# EAGLE schematic projetoFinal (EAGLE 9.6.2)

## Sheet 1 of 7
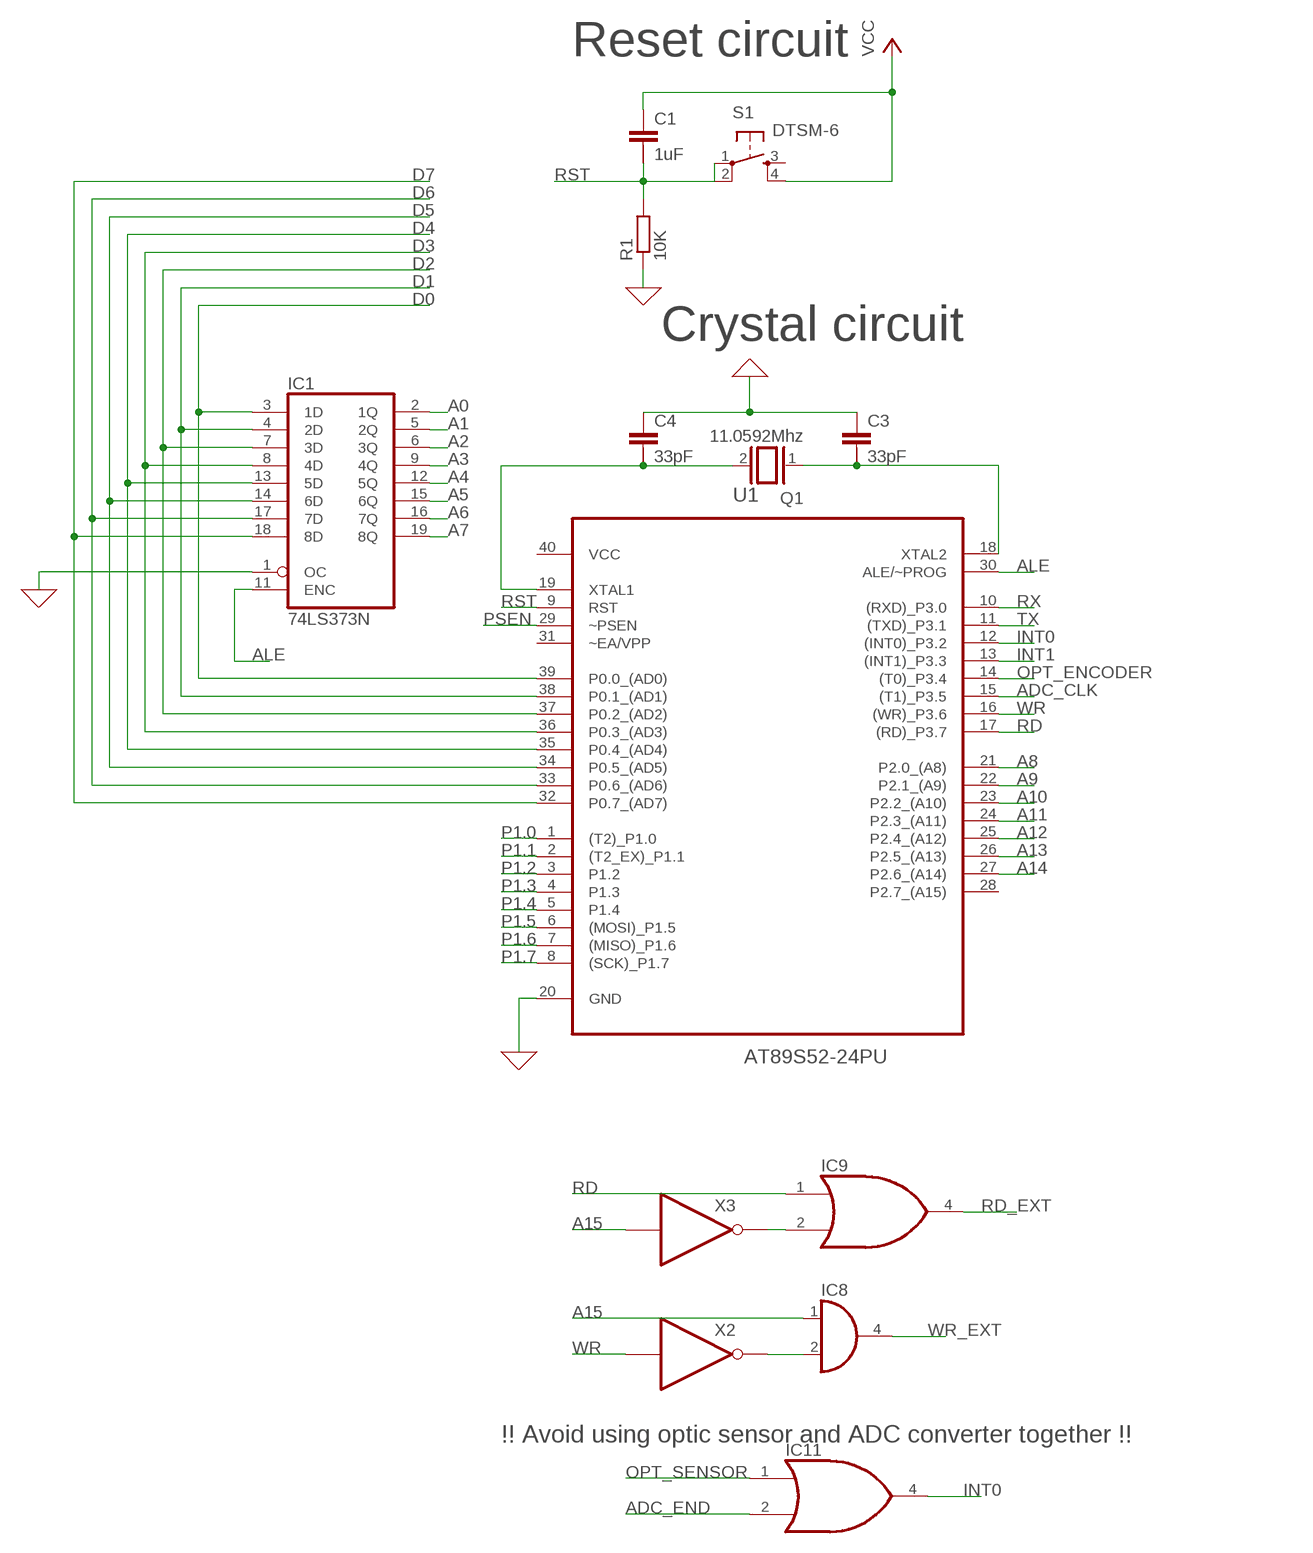
[diagram p0: schematic, sheet 1]

### Parts
C1  1uF  C-2.5-5/2  [C2.5/5-2]
C3  33pF  C-2.5-5/2  [C2.5/5-2]
C4  33pF  C-2.5-5/2  [C2.5/5-2]
IC1  74LS373N  [DIL20]
IC8  74LVC1G08DBV  [SOT23-5]
IC9  74AUC1G32DBV  [SOT23-5]
IC11  74AUC1G32DBV  [SOT23-5]
Q1  11.0592Mhz  XTAL  [Q]
R1  10K  R-EU_0204/7  [0204/7]
S1  DTSM-6  [DTSM-6]
U1  AT89S52-24PU  [DIP254P1524X482-40]
X2  INVERTER  (no package)
X3  INVERTER  (no package)

### Nets
0: C3.1 C4.1 IC1.1(OC) R1.1 U1.20(GND) ; supply symbol labelled GND ; also sheet 2,3,4,5,6,7
A0: IC1.2(1Q) ; also sheet 3,4,5,6,7
A1: IC1.5(2Q) ; also sheet 3,5,6,7
A2: IC1.6(3Q) ; also sheet 3,4,5,6,7
A3: IC1.9(4Q) ; also sheet 3,4,5,6,7
A4: IC1.12(5Q) ; also sheet 7
A5: IC1.15(6Q) ; also sheet 7
A6: IC1.16(7Q) ; also sheet 7
A7: IC1.19(8Q) ; also sheet 7
A8: U1.21(P2.0_(A8)) ; also sheet 7
A9: U1.22(P2.1_(A9)) ; also sheet 7
A10: U1.23(P2.2_(A10)) ; also sheet 7
A11: U1.24(P2.3_(A11)) ; also sheet 7
A12: U1.25(P2.4_(A12)) ; also sheet 7
A13: U1.26(P2.5_(A13)) ; also sheet 7
A14: U1.27(P2.6_(A14)) ; also sheet 7
A15: IC8.1(I0) X3.I ; also sheet 7
ADC_CLK: U1.15((T1)_P3.5) ; also sheet 3
ADC_END: IC11.2(I1) ; also sheet 3
ALE: IC1.11(ENC) U1.30(ALE/~PROG)
D0: IC1.3(1D) U1.39(P0.0_(AD0)) ; also sheet 3,4,5,6,7
D1: IC1.4(2D) U1.38(P0.1_(AD1)) ; also sheet 3,4,5,6,7
D2: IC1.7(3D) U1.37(P0.2_(AD2)) ; also sheet 3,4,5,6,7
D3: IC1.8(4D) U1.36(P0.3_(AD3)) ; also sheet 3,4,5,6,7
D4: IC1.13(5D) U1.35(P0.4_(AD4)) ; also sheet 3,4,5,6,7
D5: IC1.14(6D) U1.34(P0.5_(AD5)) ; also sheet 3,4,5,6,7
D6: IC1.17(7D) U1.33(P0.6_(AD6)) ; also sheet 3,4,5,6,7
D7: IC1.18(8D) U1.32(P0.7_(AD7)) ; also sheet 3,4,5,6,7
INT0: IC11.4(O) U1.12((INT0)_P3.2) ; also sheet 4
INT1: U1.13((INT1)_P3.3)
N$1: C4.2 Q1.2 U1.19(XTAL1)
N$2: C3.2 Q1.1 U1.18(XTAL2)
N$31: IC8.2(I1) X2.O
N$32: IC9.2(I1) X3.O
OPT_ENCODER: U1.14((T0)_P3.4) ; also sheet 2
OPT_SENSOR: IC11.1(I0) ; also sheet 2
P1.0: U1.1((T2)_P1.0) ; also sheet 5
P1.1: U1.2((T2_EX)_P1.1) ; also sheet 5
P1.2: U1.3(P1.2) ; also sheet 5
P1.3: U1.4(P1.3)
P1.4: U1.5(P1.4)
P1.5: U1.6((MOSI)_P1.5)
P1.6: U1.7((MISO)_P1.6)
P1.7: U1.8((SCK)_P1.7)
PSEN: U1.29(~PSEN) ; also sheet 7
RD: IC9.1(I0) U1.17((RD)_P3.7) ; also sheet 7
RD_EXT: IC9.4(O) ; also sheet 3,4
RST: C1.2 R1.2 S1.1 S1.2 U1.9(RST)
RX: U1.10((RXD)_P3.0) ; also sheet 2
TX: U1.11((TXD)_P3.1) ; also sheet 2
VCC: C1.1 S1.4 ; also sheet 2,3,4,5,7
WR: U1.16((WR)_P3.6) X2.I ; also sheet 7
WR_EXT: IC8.4(O) ; also sheet 3,4,5,6
Unconnected: C1.3 C3.3 C4.3 S1.3 U1.28(P2.7_(A15)) U1.31(~EA/VPP)

### Notes on the sheet
- Reset circuit
- Crystal circuit
- !! Avoid using optic sensor and ADC converter together !!

## Sheet 2 of 7
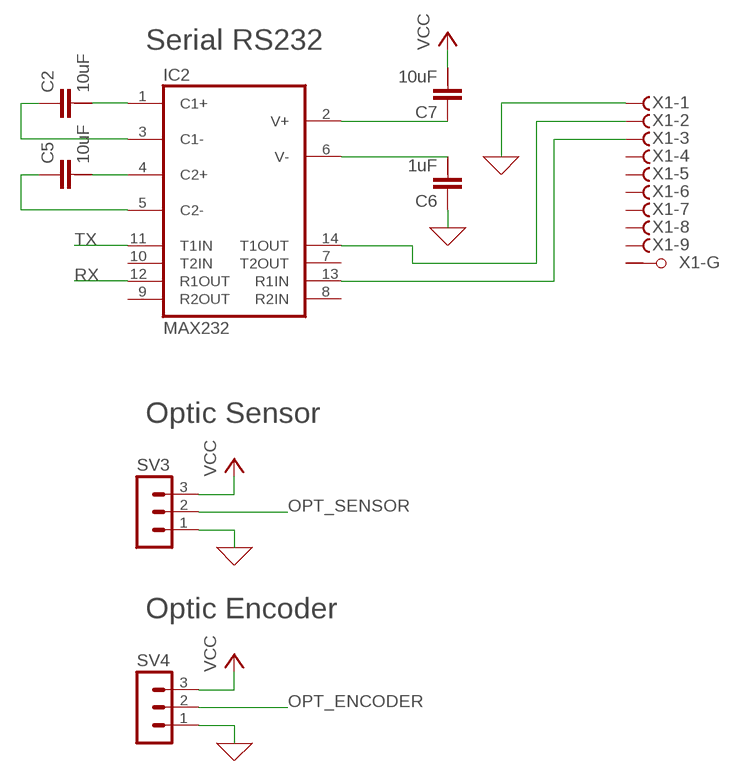
[diagram p1: schematic, sheet 2]

### Parts
C2  10uF  C-2.5-5/2  [C2.5/5-2]
C5  10uF  C-2.5-5/2  [C2.5/5-2]
C6  1uF  C-2.5-5/2  [C2.5/5-2]
C7  10uF  C-2.5-5/2  [C2.5/5-2]
IC2  MAX232  [DIL16]
SV3  MA03-1  [MA03-1]
SV4  MA03-1  [MA03-1]
X1  F09VPS  [F09VP]

### Nets
0: C6.1 C6.2 IC2.6(V-) SV3.1 SV4.1 X1.1(-1:F) ; supply symbol labelled GND ; also sheet 1,3,4,5,6,7
N$3: C2.2 IC2.1(C1+)
N$4: C2.1 IC2.3(C1-)
N$5: C5.2 IC2.4(C2+)
N$6: C5.1 IC2.5(C2-)
N$7: C7.1 IC2.2(V+)
N$8: IC2.14(T1OUT) X1.2(-2:F)
N$9: IC2.13(R1IN) X1.3(-3:F)
OPT_ENCODER: SV4.2 ; also sheet 1
OPT_SENSOR: SV3.2 ; also sheet 1
RX: IC2.12(R1OUT) ; also sheet 1
TX: IC2.11(T1IN) ; also sheet 1
VCC: C7.2 SV3.3 SV4.3 ; also sheet 1,3,4,5,7
Unconnected: C2.3 C5.3 C6.3 C7.3 IC2.7(T2OUT) IC2.8(R2IN) IC2.9(R2OUT) IC2.10(T2IN) X1.4(-4:F) X1.5(-5:F) X1.6(-6:F) X1.7(-7:F) X1.8(-8:F) X1.9(-9:F) X1.G1(-G:G1) X1.G2(-G:G2)

### Notes on the sheet
- Serial RS232
- Optic Sensor
- Optic Encoder

## Sheet 3 of 7
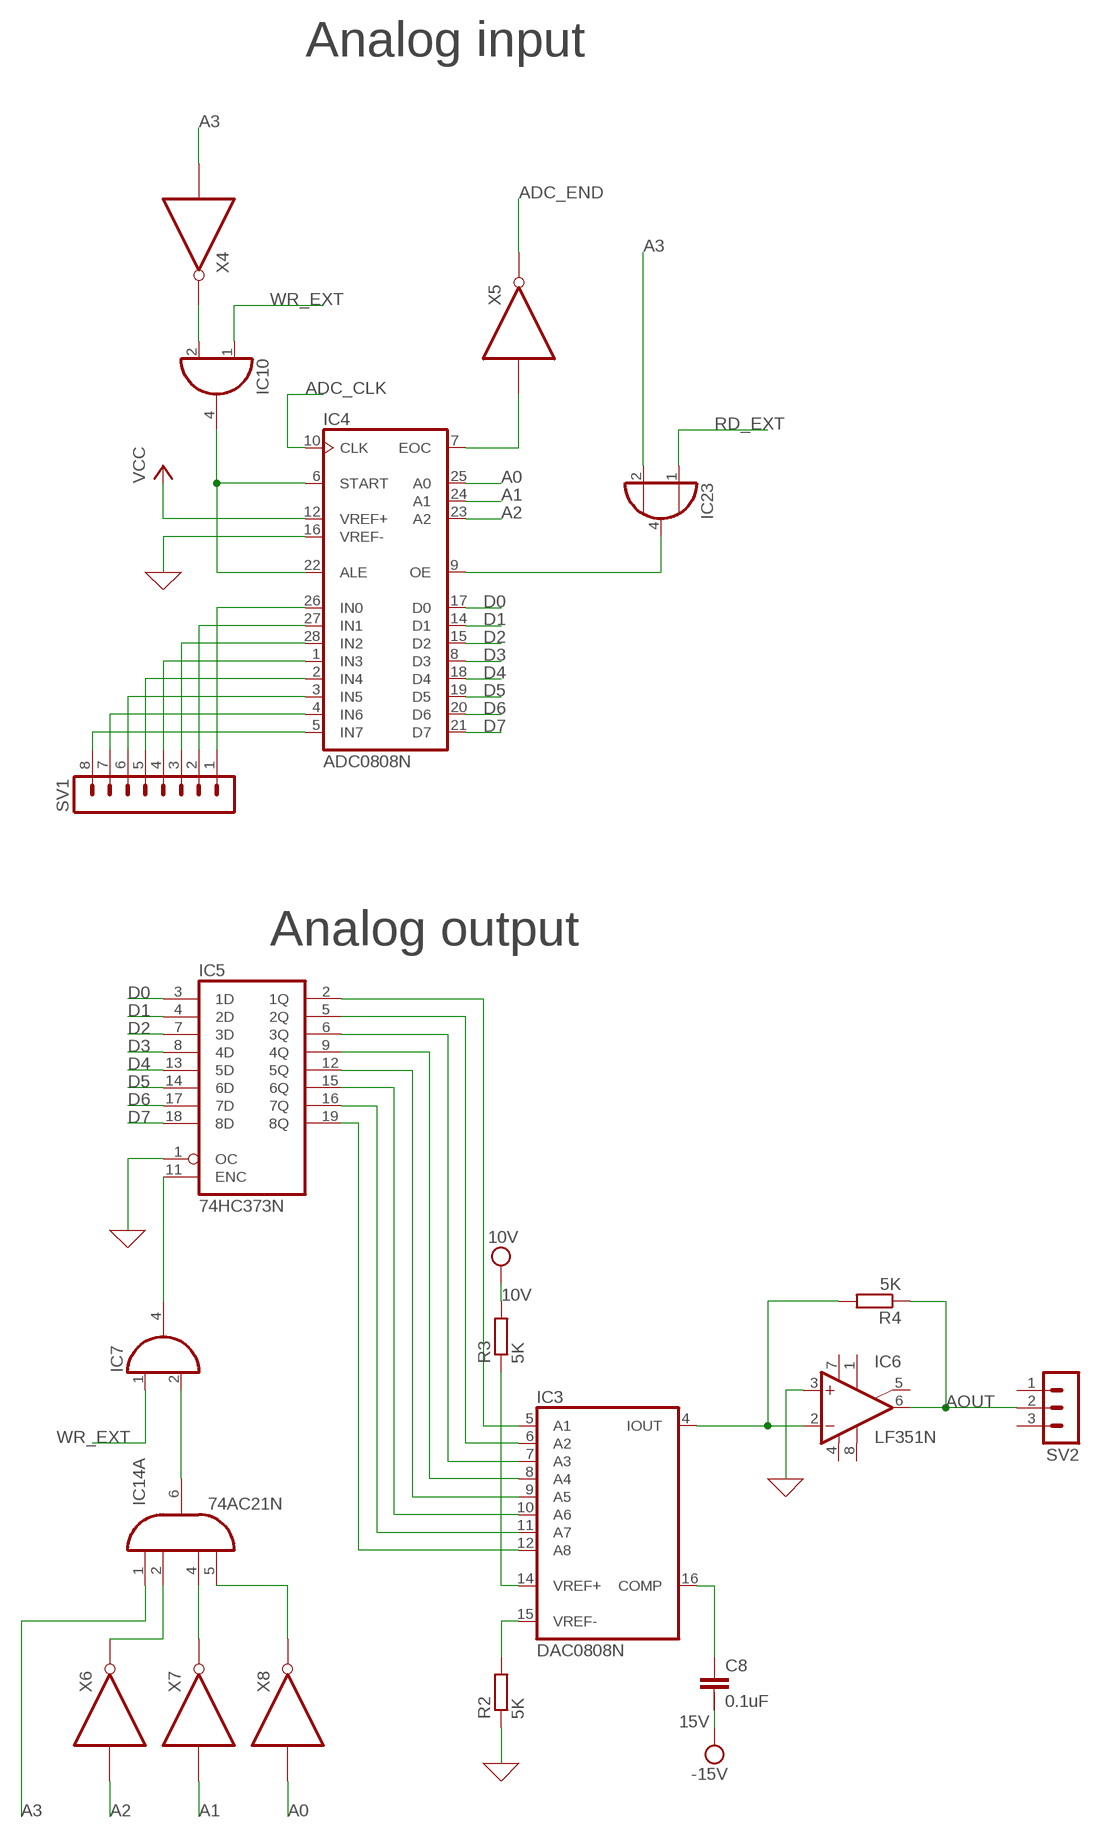
[diagram p2: schematic, sheet 3]

### Parts
C8  0.1uF  C-2.5-5/2  [C2.5/5-2]
IC3  DAC0808N  [DIL16]
IC4  ADC0808N  [DIL28-6]
IC5  74HC373N  [DIL20]
IC6  LF351N  [DIL08]
IC7  74LVC1G08DBV  [SOT23-5]
IC10  74LVC1G08DBV  [SOT23-5]
IC14  74AC21N  [DIL14]
IC23  74AHCT1G32DBV  [SOT23-5]
R2  5K  R-EU_0204/7  [0204/7]
R3  5K  R-EU_0204/7  [0204/7]
R4  5K  R-EU_0204/7  [0204/7]
SV1  MA08-1  [MA08-1]
SV2  MA03-1  [MA03-1]
X4  INVERTER  (no package)
X5  INVERTER  (no package)
X6  INVERTER  (no package)
X7  INVERTER  (no package)
X8  INVERTER  (no package)

### Nets
0: IC4.16(VREF-) IC5.1(OC) IC6.3(+IN) R2.1 ; supply symbol labelled GND ; also sheet 1,2,4,5,6,7
10V: R3.2
15V: C8.2 ; supply symbol labelled -15V
A0: IC4.25(A0) X8.I ; also sheet 1,4,5,6,7
A1: IC4.24(A1) X7.I ; also sheet 1,5,6,7
A2: IC4.23(A2) X6.I ; also sheet 1,4,5,6,7
A3: IC14.1(A:I0) X4.I ; also sheet 1,4,5,6,7
ADC_CLK: IC4.10(CLK) ; also sheet 1
ADC_END: X5.O ; also sheet 1
AOUT: IC6.6(OUT) R4.1 SV2.2
D0: IC4.17(D0) IC5.3(1D) ; also sheet 1,4,5,6,7
D1: IC4.14(D1) IC5.4(2D) ; also sheet 1,4,5,6,7
D2: IC4.15(D2) IC5.7(3D) ; also sheet 1,4,5,6,7
D3: IC4.8(D3) IC5.8(4D) ; also sheet 1,4,5,6,7
D4: IC4.18(D4) IC5.13(5D) ; also sheet 1,4,5,6,7
D5: IC4.19(D5) IC5.14(6D) ; also sheet 1,4,5,6,7
D6: IC4.20(D6) IC5.17(7D) ; also sheet 1,4,5,6,7
D7: IC4.21(D7) IC5.18(8D) ; also sheet 1,4,5,6,7
N$10: IC4.26(IN0) SV1.1
N$11: IC4.27(IN1) SV1.2
N$12: IC4.28(IN2) SV1.3
N$13: IC4.1(IN3) SV1.4
N$14: IC4.2(IN4) SV1.5
N$15: IC4.3(IN5) SV1.6
N$16: IC4.4(IN6) SV1.7
N$17: IC4.5(IN7) SV1.8
N$18: IC3.5(A1) IC5.2(1Q)
N$19: IC3.6(A2) IC5.5(2Q)
N$20: IC3.7(A3) IC5.6(3Q)
N$21: IC3.8(A4) IC5.9(4Q)
N$22: IC3.9(A5) IC5.12(5Q)
N$23: IC3.10(A6) IC5.15(6Q)
N$24: IC3.11(A7) IC5.16(7Q)
N$25: IC3.12(A8) IC5.19(8Q)
N$26: IC5.11(ENC) IC7.4(O)
N$27: IC3.15(VREF-) R2.2
N$28: IC3.14(VREF+) R3.1
N$29: C8.1 IC3.16(COMP)
N$30: IC3.4(IOUT) IC6.2(-IN) R4.2
N$33: IC23.2(I1)
N$34: IC4.9(OE) IC23.4(O)
N$41: IC4.6(START) IC4.22(ALE) IC10.4(O)
N$42: IC10.2(I1) X4.O
N$43: IC4.7(EOC) X5.I
N$69: IC14.2(A:I1) X6.O
N$70: IC14.4(A:I2) X7.O
N$71: IC14.5(A:I3) X8.O
N$76: IC7.2(I1) IC14.6(A:O)
RD_EXT: IC23.1(I0) ; also sheet 1,4
VCC: IC4.12(VREF+) ; also sheet 1,2,4,5,7
WR_EXT: IC7.1(I0) IC10.1(I0) ; also sheet 1,4,5,6
Unconnected: C8.3 IC6.1(ON1) IC6.5(ON2) IC6.8(OPT) IC14.8(B:O) IC14.9(B:I0) IC14.10(B:I1) IC14.12(B:I2) IC14.13(B:I3) SV2.1 SV2.3

### Notes on the sheet
- Analog input
- Analog output

## Sheet 4 of 7
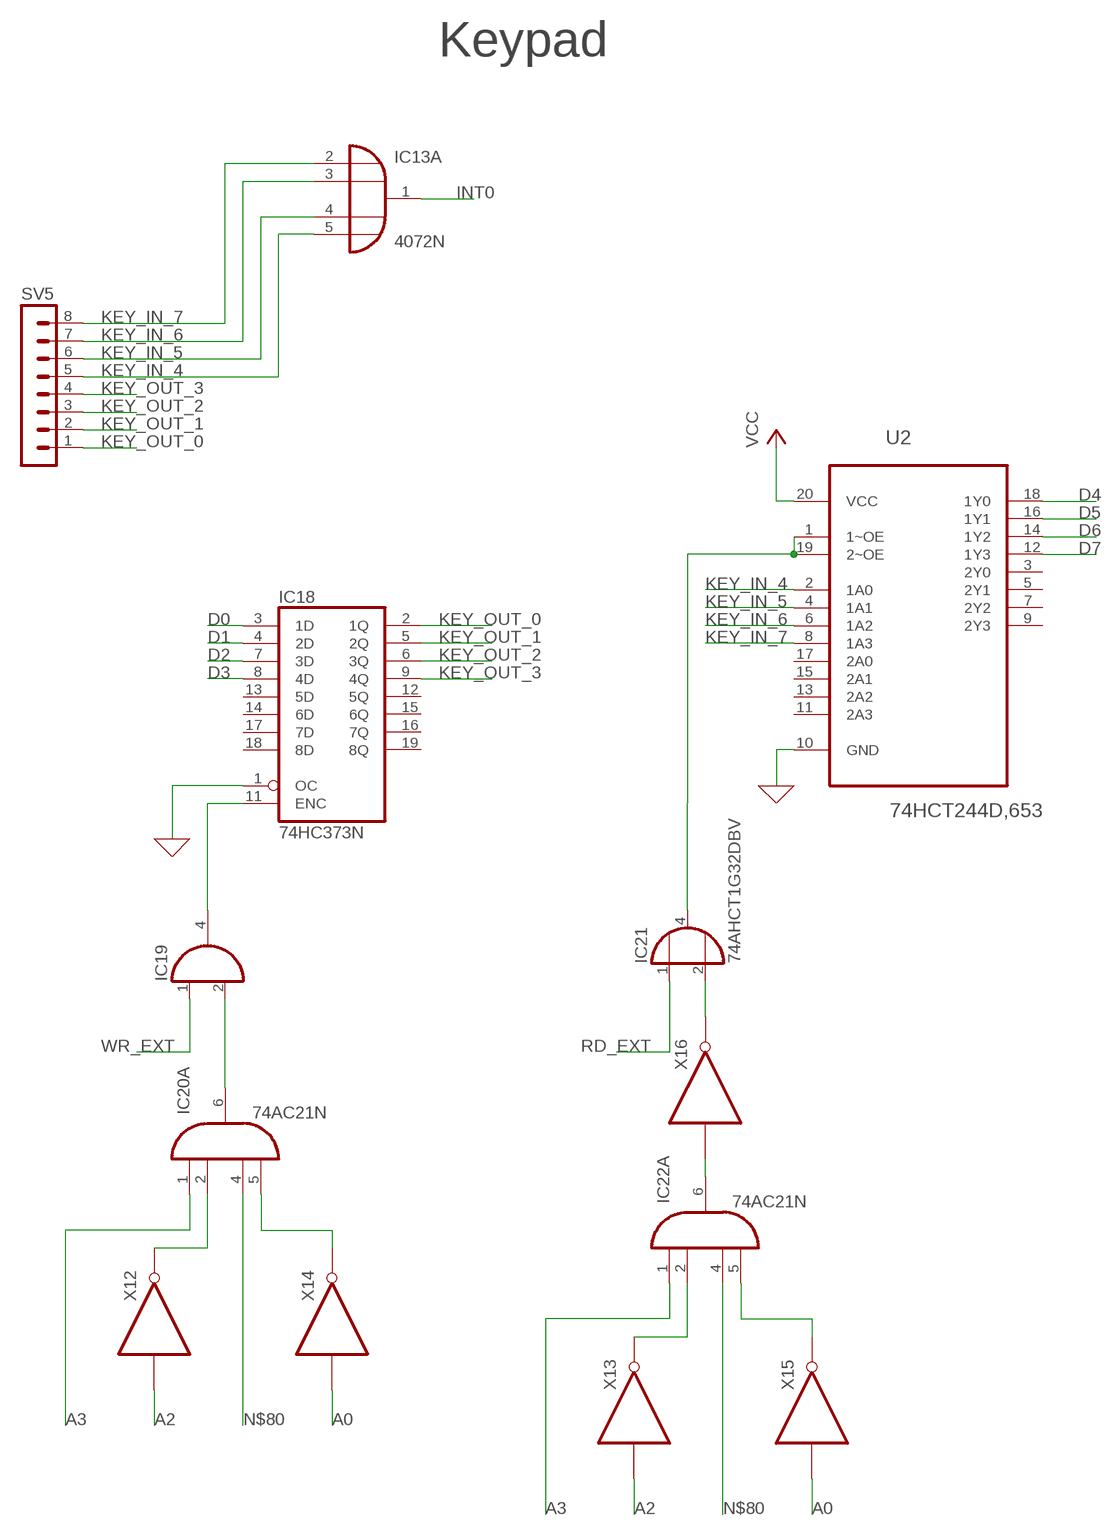
[diagram p3: schematic, sheet 4]

### Parts
IC13  4072N  [DIL14]
IC18  74HC373N  [DIL20]
IC19  74LVC1G08DBV  [SOT23-5]
IC20  74AC21N  [DIL14]
IC21  74AHCT1G32DBV  [SOT23-5]
IC22  74AC21N  [DIL14]
SV5  MA08-1  [MA08-1]
U2  74HCT244D,653  [SOIC127X1032X265-20N]
X12  INVERTER  (no package)
X13  INVERTER  (no package)
X14  INVERTER  (no package)
X15  INVERTER  (no package)
X16  INVERTER  (no package)

### Nets
0: IC18.1(OC) U2.10(GND) ; supply symbol labelled GND ; also sheet 1,2,3,5,6,7
A0: X14.I X15.I ; also sheet 1,3,5,6,7
A2: X12.I X13.I ; also sheet 1,3,5,6,7
A3: IC20.1(A:I0) IC22.1(A:I0) ; also sheet 1,3,5,6,7
D0: IC18.3(1D) ; also sheet 1,3,5,6,7
D1: IC18.4(2D) ; also sheet 1,3,5,6,7
D2: IC18.7(3D) ; also sheet 1,3,5,6,7
D3: IC18.8(4D) ; also sheet 1,3,5,6,7
D4: U2.18(1Y0) ; also sheet 1,3,5,6,7
D5: U2.16(1Y1) ; also sheet 1,3,5,6,7
D6: U2.14(1Y2) ; also sheet 1,3,5,6,7
D7: U2.12(1Y3) ; also sheet 1,3,5,6,7
INT0: IC13.1(A:O) ; also sheet 1
KEY_IN_4: IC13.5(A:I3) SV5.5 U2.2(1A0)
KEY_IN_5: SV5.6 U2.4(1A1)
KEY_IN_6: IC13.3(A:I1) SV5.7 U2.6(1A2)
KEY_IN_7: IC13.2(A:I0) SV5.8 U2.8(1A3)
KEY_OUT_0: IC18.2(1Q) SV5.1
KEY_OUT_1: IC18.5(2Q) SV5.2
KEY_OUT_2: IC18.6(3Q) SV5.3
KEY_OUT_3: IC18.9(4Q) SV5.4
N$36: IC20.5(A:I3) X14.O
N$37: IC13.4(A:I2)
N$38: IC22.2(A:I1) X13.O
N$39: IC21.2(I1) X16.O
N$40: IC21.4(O)
N$72: IC22.5(A:I3) X15.O
N$75: IC22.6(A:O) X16.I
N$78: U2.1(1~OE) U2.19(2~OE)
N$79: IC20.2(A:I1) X12.O
N$80: IC20.4(A:I2) IC22.4(A:I2)
N$81: IC19.2(I1) IC20.6(A:O)
N$82: IC18.11(ENC) IC19.4(O)
RD_EXT: IC21.1(I0) ; also sheet 1,3
VCC: U2.20(VCC) ; also sheet 1,2,3,5,7
WR_EXT: IC19.1(I0) ; also sheet 1,3,5,6
Unconnected: IC13.9(B:I0) IC13.10(B:I1) IC13.11(B:I2) IC13.12(B:I3) IC13.13(B:O) IC18.12(5Q) IC18.13(5D) IC18.14(6D) IC18.15(6Q) IC18.16(7Q) IC18.17(7D) IC18.18(8D) IC18.19(8Q) IC20.8(B:O) IC20.9(B:I0) IC20.10(B:I1) IC20.12(B:I2) IC20.13(B:I3) IC22.8(B:O) IC22.9(B:I0) IC22.10(B:I1) IC22.12(B:I2) IC22.13(B:I3) U2.3(2Y0) U2.5(2Y1) U2.7(2Y2) U2.9(2Y3) U2.11(2A3) U2.13(2A2) U2.15(2A1) U2.17(2A0)

### Notes on the sheet
- Keypad

## Sheet 5 of 7
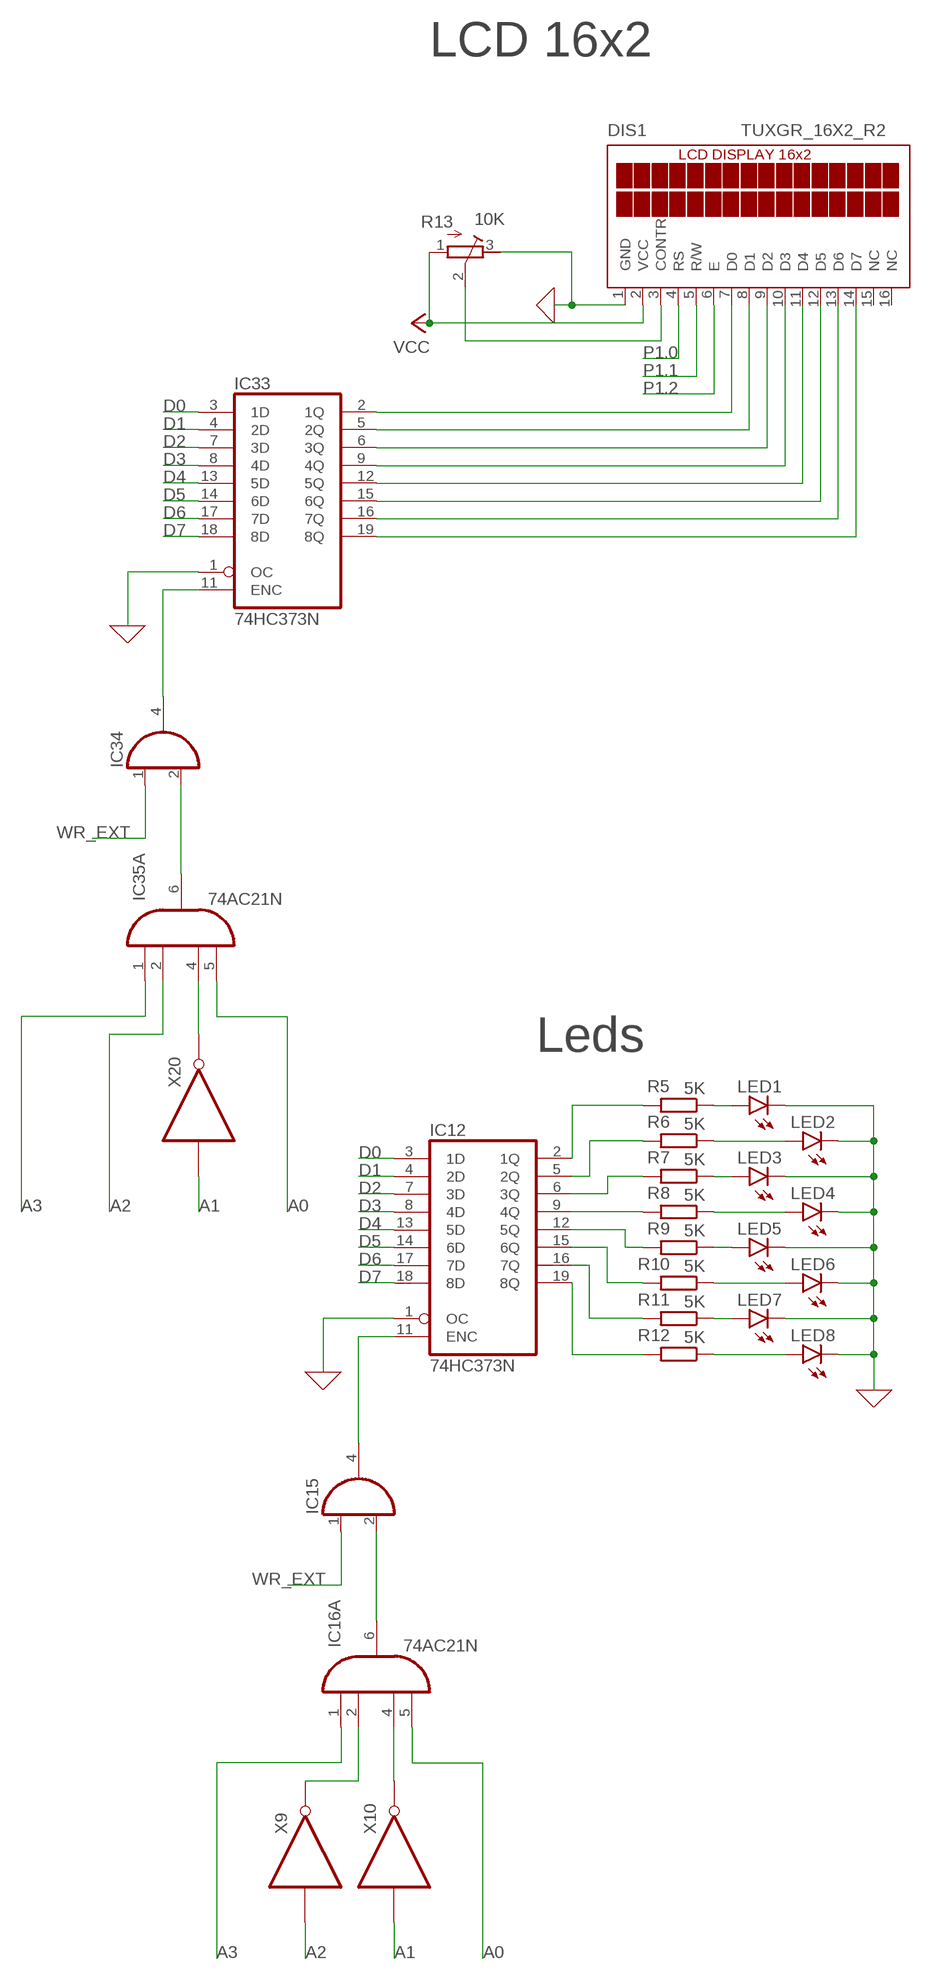
[diagram p4: schematic, sheet 5]

### Parts
DIS1  TUXGR_16X2_R2  [TUXGR_16X2_R2]
IC12  74HC373N  [DIL20]
IC15  74LVC1G08DBV  [SOT23-5]
IC16  74AC21N  [DIL14]
IC33  74HC373N  [DIL20]
IC34  74LVC1G08DBV  [SOT23-5]
IC35  74AC21N  [DIL14]
LED1  TLLR4400  [LED3MM]
LED2  TLLR4400  [LED3MM]
LED3  TLLR4400  [LED3MM]
LED4  TLLR4400  [LED3MM]
LED5  TLLR4400  [LED3MM]
LED6  TLLR4400  [LED3MM]
LED7  TLLR4400  [LED3MM]
LED8  TLLR4400  [LED3MM]
R5  5K  R-EU_0204/7  [0204/7]
R6  5K  R-EU_0204/7  [0204/7]
R7  5K  R-EU_0204/7  [0204/7]
R8  5K  R-EU_0204/7  [0204/7]
R9  5K  R-EU_0204/7  [0204/7]
R10  5K  R-EU_0204/7  [0204/7]
R11  5K  R-EU_0204/7  [0204/7]
R12  5K  R-EU_0204/7  [0204/7]
R13  10K  R-TRIMM3339P  [RTRIM3339P]
X9  INVERTER  (no package)
X10  INVERTER  (no package)
X20  INVERTER  (no package)

### Nets
0: DIS1.1(GND) IC12.1(OC) IC33.1(OC) R13.3(E) ; supply symbol labelled GND ; also sheet 1,2,3,4,6,7
A0: IC16.5(A:I3) IC35.5(A:I3) ; also sheet 1,3,4,6,7
A1: X10.I X20.I ; also sheet 1,3,6,7
A2: IC35.2(A:I1) X9.I ; also sheet 1,3,4,6,7
A3: IC16.1(A:I0) IC35.1(A:I0) ; also sheet 1,3,4,6,7
D0: IC12.3(1D) IC33.3(1D) ; also sheet 1,3,4,6,7
D1: IC12.4(2D) IC33.4(2D) ; also sheet 1,3,4,6,7
D2: IC12.7(3D) IC33.7(3D) ; also sheet 1,3,4,6,7
D3: IC12.8(4D) IC33.8(4D) ; also sheet 1,3,4,6,7
D4: IC12.13(5D) IC33.13(5D) ; also sheet 1,3,4,6,7
D5: IC12.14(6D) IC33.14(6D) ; also sheet 1,3,4,6,7
D6: IC12.17(7D) IC33.17(7D) ; also sheet 1,3,4,6,7
D7: IC12.18(8D) IC33.18(8D) ; also sheet 1,3,4,6,7
N$35: IC12.11(ENC) IC15.4(O)
N$44: DIS1.7(D0) IC33.2(1Q)
N$45: DIS1.8(D1) IC33.5(2Q)
N$46: DIS1.9(D2) IC33.6(3Q)
N$47: DIS1.10(D3) IC33.9(4Q)
N$48: DIS1.11(D4) IC33.12(5Q)
N$49: DIS1.12(D5) IC33.15(6Q)
N$50: DIS1.13(D6) IC33.16(7Q)
N$51: DIS1.14(D7) IC33.19(8Q)
N$52: LED1.A R5.1
N$53: LED2.A R6.1
N$54: LED3.A R7.1
N$55: LED4.A R8.1
N$56: LED5.A R9.1
N$57: LED6.A R10.1
N$58: LED7.A R11.1
N$59: LED8.A R12.1
N$60: IC12.2(1Q) R5.2
N$61: LED1.K(C) LED2.K(C) LED3.K(C) LED4.K(C) LED5.K(C) LED6.K(C) LED7.K(C) LED8.K(C) ; supply symbol labelled GND
N$62: IC12.5(2Q) R6.2
N$63: IC12.6(3Q) R7.2
N$64: IC12.9(4Q) R8.2
N$65: IC12.19(8Q) R12.2
N$66: IC12.16(7Q) R11.2
N$67: IC12.15(6Q) R10.2
N$68: IC12.12(5Q) R9.2
N$73: IC16.2(A:I1) X9.O
N$74: IC16.4(A:I2) X10.O
N$77: IC15.2(I1) IC16.6(A:O)
N$108: DIS1.3(CONTR) R13.2(S)
N$119: IC35.4(A:I2) X20.O
N$125: IC34.2(I1) IC35.6(A:O)
N$126: IC33.11(ENC) IC34.4(O)
P1.0: DIS1.4(RS) ; also sheet 1
P1.1: DIS1.5(R/W) ; also sheet 1
P1.2: DIS1.6(E) ; also sheet 1
VCC: DIS1.2(VCC) R13.1(A) ; also sheet 1,2,3,4,7
WR_EXT: IC15.1(I0) IC34.1(I0) ; also sheet 1,3,4,6
Unconnected: DIS1.15(NC) DIS1.16(NC) IC16.8(B:O) IC16.9(B:I0) IC16.10(B:I1) IC16.12(B:I2) IC16.13(B:I3) IC35.8(B:O) IC35.9(B:I0) IC35.10(B:I1) IC35.12(B:I2) IC35.13(B:I3)

### Notes on the sheet
- LCD 16x2
- Leds

## Sheet 6 of 7
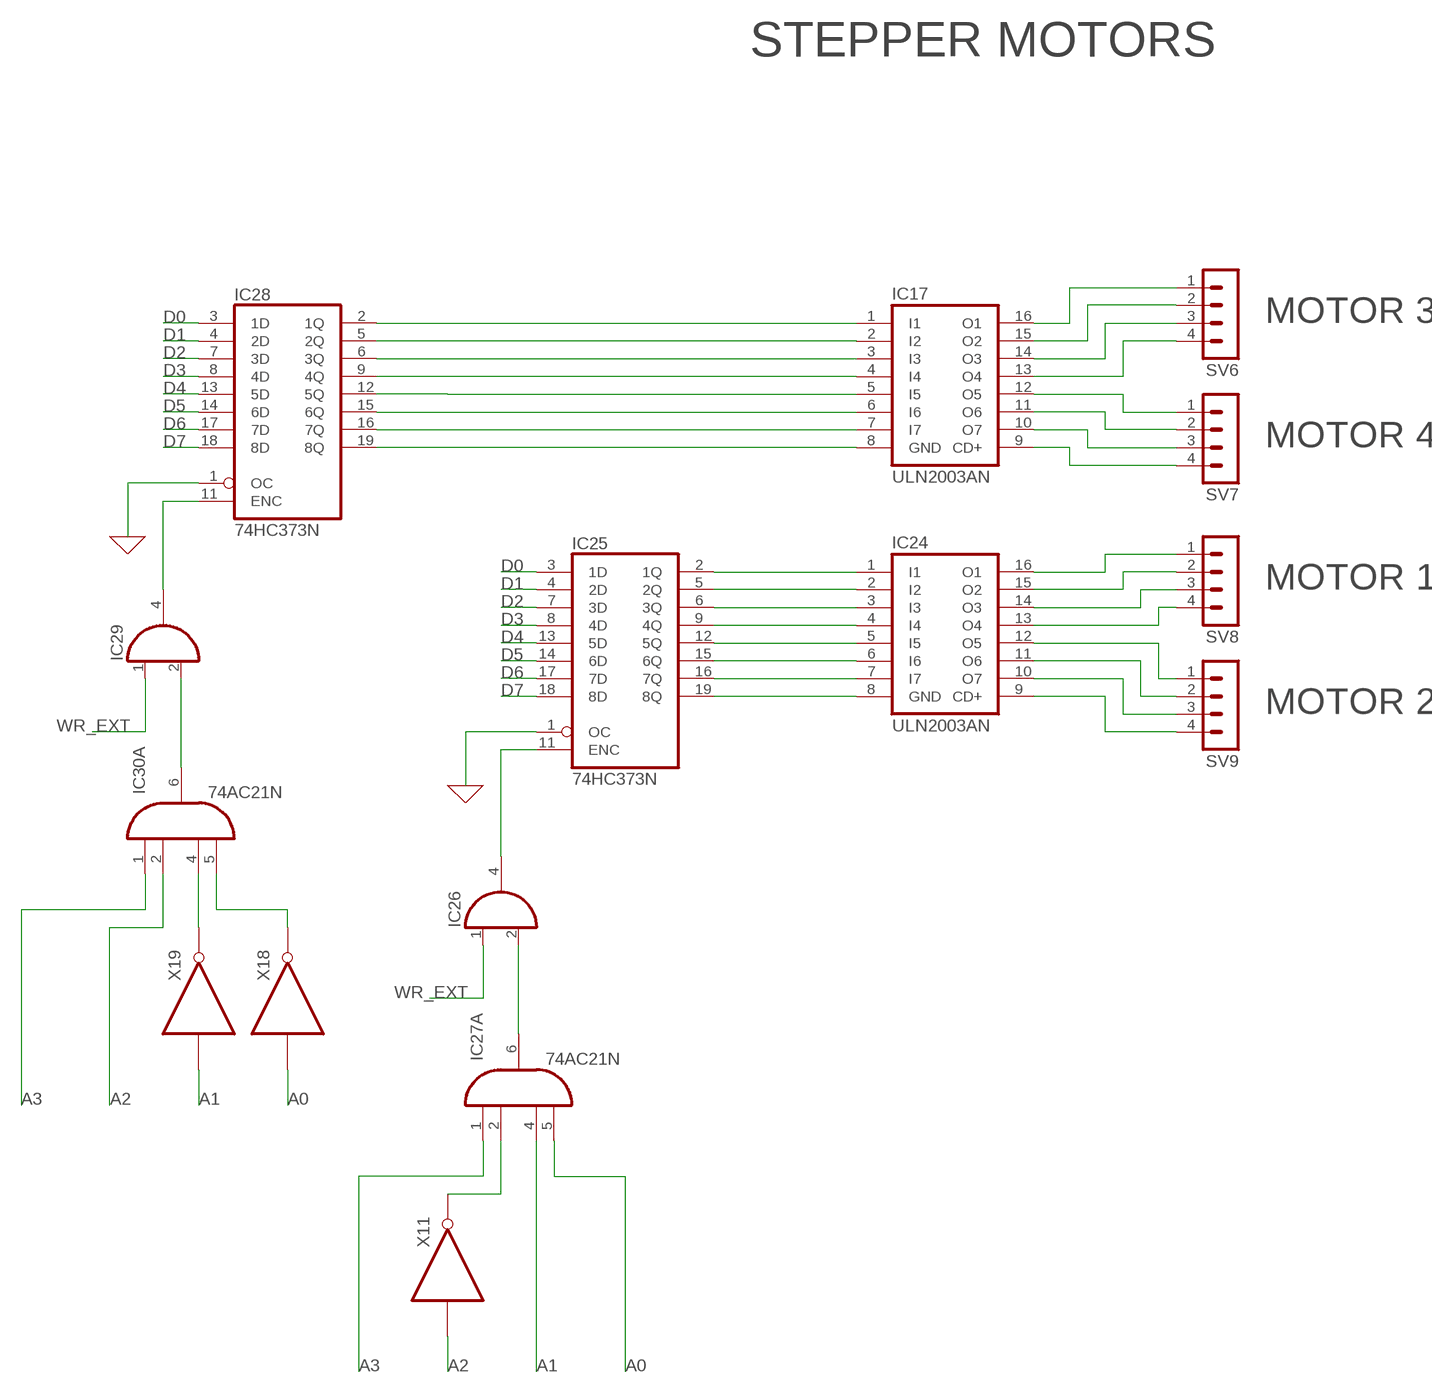
[diagram p5: schematic, sheet 6]

### Parts
IC17  ULN2003AN  [DIL16]
IC24  ULN2003AN  [DIL16]
IC25  74HC373N  [DIL20]
IC26  74LVC1G08DBV  [SOT23-5]
IC27  74AC21N  [DIL14]
IC28  74HC373N  [DIL20]
IC29  74LVC1G08DBV  [SOT23-5]
IC30  74AC21N  [DIL14]
SV6  MA04-1  [MA04-1]
SV7  MA04-1  [MA04-1]
SV8  MA04-1  [MA04-1]
SV9  MA04-1  [MA04-1]
X11  INVERTER  (no package)
X18  INVERTER  (no package)
X19  INVERTER  (no package)

### Nets
0: IC25.1(OC) IC28.1(OC) ; supply symbol labelled GND ; also sheet 1,2,3,4,5,7
A0: IC27.5(A:I3) X18.I ; also sheet 1,3,4,5,7
A1: IC27.4(A:I2) X19.I ; also sheet 1,3,5,7
A2: IC30.2(A:I1) X11.I ; also sheet 1,3,4,5,7
A3: IC27.1(A:I0) IC30.1(A:I0) ; also sheet 1,3,4,5,7
D0: IC25.3(1D) IC28.3(1D) ; also sheet 1,3,4,5,7
D1: IC25.4(2D) IC28.4(2D) ; also sheet 1,3,4,5,7
D2: IC25.7(3D) IC28.7(3D) ; also sheet 1,3,4,5,7
D3: IC25.8(4D) IC28.8(4D) ; also sheet 1,3,4,5,7
D4: IC25.13(5D) IC28.13(5D) ; also sheet 1,3,4,5,7
D5: IC25.14(6D) IC28.14(6D) ; also sheet 1,3,4,5,7
D6: IC25.17(7D) IC28.17(7D) ; also sheet 1,3,4,5,7
D7: IC25.18(8D) IC28.18(8D) ; also sheet 1,3,4,5,7
N$83: IC17.16(O1) SV6.1
N$84: IC17.15(O2) SV6.2
N$85: IC17.14(O3) SV6.3
N$86: IC17.13(O4) SV6.4
N$87: IC17.12(O5) SV7.1
N$88: IC17.11(O6) SV7.2
N$89: IC17.10(O7) SV7.3
N$90: IC17.9(CD+) SV7.4
N$91: IC24.16(O1) SV8.1
N$92: IC24.15(O2) SV8.2
N$93: IC24.14(O3) SV8.3
N$94: IC24.13(O4) SV8.4
N$95: IC24.12(O5) SV9.1
N$96: IC24.11(O6) SV9.2
N$97: IC24.10(O7) SV9.3
N$98: IC24.9(CD+) SV9.4
N$99: IC24.1(I1) IC25.2(1Q)
N$100: IC24.2(I2) IC25.5(2Q)
N$101: IC24.3(I3) IC25.6(3Q)
N$102: IC24.4(I4) IC25.9(4Q)
N$103: IC24.8(GND) IC25.19(8Q)
N$104: IC24.7(I7) IC25.16(7Q)
N$105: IC24.6(I6) IC25.15(6Q)
N$106: IC24.5(I5) IC25.12(5Q)
N$107: IC27.2(A:I1) X11.O
N$109: IC26.2(I1) IC27.6(A:O)
N$110: IC25.11(ENC) IC26.4(O)
N$111: IC17.1(I1) IC28.2(1Q)
N$112: IC17.2(I2) IC28.5(2Q)
N$113: IC17.3(I3) IC28.6(3Q)
N$114: IC17.4(I4) IC28.9(4Q)
N$115: IC17.5(I5)
N$116: IC17.7(I7) IC28.16(7Q)
N$117: IC17.6(I6) IC28.15(6Q)
N$118: IC28.12(5Q)
N$120: IC30.4(A:I2) X19.O
N$121: IC29.2(I1) IC30.6(A:O)
N$122: IC28.11(ENC) IC29.4(O)
N$123: IC17.8(GND) IC28.19(8Q)
N$124: IC30.5(A:I3) X18.O
WR_EXT: IC26.1(I0) IC29.1(I0) ; also sheet 1,3,4,5
Unconnected: IC27.8(B:O) IC27.9(B:I0) IC27.10(B:I1) IC27.12(B:I2) IC27.13(B:I3) IC30.8(B:O) IC30.9(B:I0) IC30.10(B:I1) IC30.12(B:I2) IC30.13(B:I3)

### Notes on the sheet
- STEPPER MOTORS
- MOTOR 3
- MOTOR 4
- MOTOR 1
- MOTOR 2

## Sheet 7 of 7
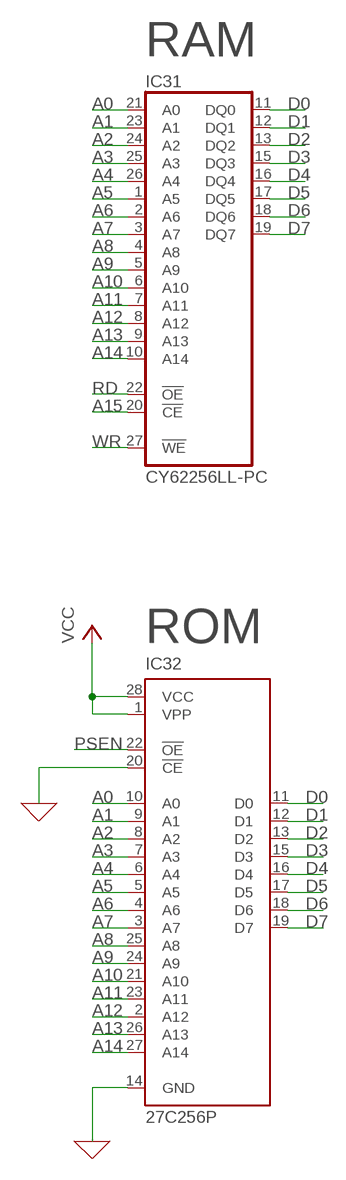
[diagram p6: schematic, sheet 7]

### Parts
IC31  CY62256LL-PC  [DIL28-6]
IC32  27C256P  [DIL28-6]

### Nets
0: IC32.14(GND) IC32.20(!CE) ; supply symbol labelled GND ; also sheet 1,2,3,4,5,6
A0: IC31.21(A0) IC32.10(A0) ; also sheet 1,3,4,5,6
A1: IC31.23(A1) IC32.9(A1) ; also sheet 1,3,5,6
A2: IC31.24(A2) IC32.8(A2) ; also sheet 1,3,4,5,6
A3: IC31.25(A3) IC32.7(A3) ; also sheet 1,3,4,5,6
A4: IC31.26(A4) IC32.6(A4) ; also sheet 1
A5: IC31.1(A5) IC32.5(A5) ; also sheet 1
A6: IC31.2(A6) IC32.4(A6) ; also sheet 1
A7: IC31.3(A7) IC32.3(A7) ; also sheet 1
A8: IC31.4(A8) IC32.25(A8) ; also sheet 1
A9: IC31.5(A9) IC32.24(A9) ; also sheet 1
A10: IC31.6(A10) IC32.21(A10) ; also sheet 1
A11: IC31.7(A11) IC32.23(A11) ; also sheet 1
A12: IC31.8(A12) IC32.2(A12) ; also sheet 1
A13: IC31.9(A13) IC32.26(A13) ; also sheet 1
A14: IC31.10(A14) IC32.27(A14) ; also sheet 1
A15: IC31.20(!CE) ; also sheet 1
D0: IC31.11(DQ0) IC32.11(D0) ; also sheet 1,3,4,5,6
D1: IC31.12(DQ1) IC32.12(D1) ; also sheet 1,3,4,5,6
D2: IC31.13(DQ2) IC32.13(D2) ; also sheet 1,3,4,5,6
D3: IC31.15(DQ3) IC32.15(D3) ; also sheet 1,3,4,5,6
D4: IC31.16(DQ4) IC32.16(D4) ; also sheet 1,3,4,5,6
D5: IC31.17(DQ5) IC32.17(D5) ; also sheet 1,3,4,5,6
D6: IC31.18(DQ6) IC32.18(D6) ; also sheet 1,3,4,5,6
D7: IC31.19(DQ7) IC32.19(D7) ; also sheet 1,3,4,5,6
PSEN: IC32.22(!OE) ; also sheet 1
RD: IC31.22(!OE) ; also sheet 1
VCC: IC32.1(VPP) IC32.28(VCC) ; also sheet 1,2,3,4,5
WR: IC31.27(!WE) ; also sheet 1

### Notes on the sheet
- RAM
- ROM

## Power pins joined to a net without a drawn wire
GND: IC1.10(GND) IC2.15(GND) IC3.2(GND) IC4.13(GND) IC5.10(GND) IC7.3(GND) IC8.3(GND) IC9.3(GND) IC10.3(GND) IC11.3(GND) IC12.10(GND) IC14.7(P:GND) IC15.3(GND) IC16.7(P:GND) IC18.10(GND) IC19.3(GND) IC20.7(P:GND) IC21.3(GND) IC22.7(P:GND) IC23.3(GND) IC25.10(GND) IC26.3(GND) IC27.7(P:GND) IC28.10(GND) IC29.3(GND) IC30.7(P:GND) IC31.14(GND) IC33.10(GND) IC34.3(GND) IC35.7(P:GND)
V+: IC6.7(V+)
V-: IC6.4(V-)
VCC: IC1.20(VCC) IC2.16(VCC) IC3.13(VCC) IC4.11(VCC) IC5.20(VCC) IC7.5(VCC) IC8.5(VCC) IC9.5(VCC) IC10.5(VCC) IC11.5(VCC) IC12.20(VCC) IC14.14(P:VCC) IC15.5(VCC) IC16.14(P:VCC) IC18.20(VCC) IC19.5(VCC) IC20.14(P:VCC) IC21.5(VCC) IC22.14(P:VCC) IC23.5(VCC) IC25.20(VCC) IC26.5(VCC) IC27.14(P:VCC) IC28.20(VCC) IC29.5(VCC) IC30.14(P:VCC) IC31.28(VCC) IC33.20(VCC) IC34.5(VCC) IC35.14(P:VCC) U1.40(VCC)
VDD: IC13.14(P:VDD)
VEE: IC3.3(VEE)
VSS: IC13.7(P:VSS)

## Library data of the parts
C1-C8 = capacitor-wima:C-: CAPACITOR for alternative placement naming: default grid - extended grid/package width
DIS1 = display-lcd:TUXGR_16X2_R2: Tuxgraphics LCD display 16x2 characters reflective, without background light Source: tuxgr_12x2_r2.pdf; OC_FARNELL: unknown; OC_NEWARK: unknown
IC1 = 74xx-eu:74*373: Octal D type transparent LATCH, edge triggered
IC2 = maxim:MAX232: RS232 TRANSCEIVER; MF: MAXIM; MPN: MAX232ACPE+; OC_FARNELL: 9723773; OC_NEWARK: 68K4544
IC3 = linear:DAC0808: 8-bit DIGITAL/ANALOG CONVERTER Source: http://www.national.com/ds/DA/DAC0808.pdf
IC4 = linear:ADC0808: 8-bit A/D CONVERTER with 8-channel multiplexer
IC5 IC12 IC18 IC25 IC28 IC33 = 74HC373:74HC373: Octal D type transparent LATCH, edge triggered Check prices <https://pricing.snapeda.com/parts/74HC373/MICROSS/On%20Semiconductor/view-part?ref=eda>; AVAILABILITY: Bad; DESCRIPTION: D-Type Transparent Latch 1 Channel 8:8 IC Tri-State 20-SO; MF: MICROSS/On Semiconductor; MP: 74HC373; PACKAGE: Die Fairchild Semiconductor; PRICE: None
IC6 = linear4:LF351: OP AMP
IC7 IC8 IC10 IC15 IC19 IC26 IC29 IC34 = 74xx-little-de:74*1G08: 2-input AND gate
IC9 IC11 = 74xx-little-us:74*1G32: 2-input OR gate
IC13 = 40xx:4072: Dual 4-input OR
IC14 IC16 IC20 IC22 IC27 IC30 IC35 = 74xx-eu:74*21: Dual 4-input AND gate
IC17 IC24 = uln-udn:ULN2003A: DRIVER ARRAY
IC21 IC23 = 74xx-little-de:74*1G32: 2-input OR gate
IC31 = memory-sram:CY62256LL-?*: 256K (32K x 8) CMOS-Static RAM Source: http://download.cypress.com.edgesuite.net/design_resources/datasheets/contents/cy62256_8.pdf
IC32 = microchip:27*256: CMOS EPROM 256 K (32 K x 8), low voltage; MF: Arrow Electronics; MPN: M27C256B15F1; OC_FARNELL: 1125431; OC_NEWARK: 93K7335
LED1-LED8 = led:TLLR4400: Low Current (2mA) LED 3 mm Tinted Diffused Package color RED Source: Data sheet <http://www.farnell.com/datasheets/391100.pdf>; MF: VISHAY SEMICONDUCTOR; OC_FARNELL: 1612437
Q1 = special:XTAL: CRYSTAL
R1-R12 = rcl:R-EU_: RESISTOR, European symbol; SPICEPREFIX: R
R13 = rcl:R-TRIMM: Trimm resistor; SPICEMODEL: X; SPICEPREFIXL: POT
S1 = switch-tact:DTSM-6
SV1 SV5 = con-lstb:MA08-1: PIN HEADER; OC_FARNELL: unknown; OC_NEWARK: unknown
SV2-SV4 = con-lstb:MA03-1: PIN HEADER; OC_FARNELL: unknown; OC_NEWARK: unknown
SV6-SV9 = con-lstb:MA04-1: PIN HEADER; OC_FARNELL: unknown; OC_NEWARK: unknown
U1 = AT89S52-24PU:AT89S52-24PU: 8-bit Microcontroller Check prices <https://pricing.snapeda.com/parts/AT89S52-24PU/Microchip/view-part?ref=eda>; AVAILABILITY: Good; DESCRIPTION: 8051 89S Microcontroller IC 8-Bit 24MHz 8KB (8K x 8) FLASH 40-PDIP; MF: Microchip; MP: AT89S52-24PU; PACKAGE: PDIP-40 Microchip; PRICE: None; PURCHASE-URL: https://pricing.snapeda.com/search/part/AT89S52-24PU/?ref=eda
U2 = 74HCT244D_653:74HCT244D,653: Octal buffer/line driver 3-state Check prices <https://pricing.snapeda.com/parts/74HCT244D%2C653/Nexperia%20USA%20Inc./view-part?ref=eda>; AVAILABILITY: Good; DESCRIPTION: Buffer, Non-Inverting 2 Element 4 Bit per Element 3-State Output 20-SO; MF: Nexperia USA Inc.; MP: 74HCT244D,653; PACKAGE: None; PRICE: None; PURCHASE-URL: https://pricing.snapeda.com/search/part/74HCT244D,653/?ref=eda
X1 = con-subd:F09VPS: SUB-D; OC_FARNELL: unknown; OC_NEWARK: unknown
X2-X16 X18-X20 = ngspice-digital:INVERTER: logic inverter (NOT gate)